# EAGLE design usbasp2lagig (EAGLE 6.6.0)
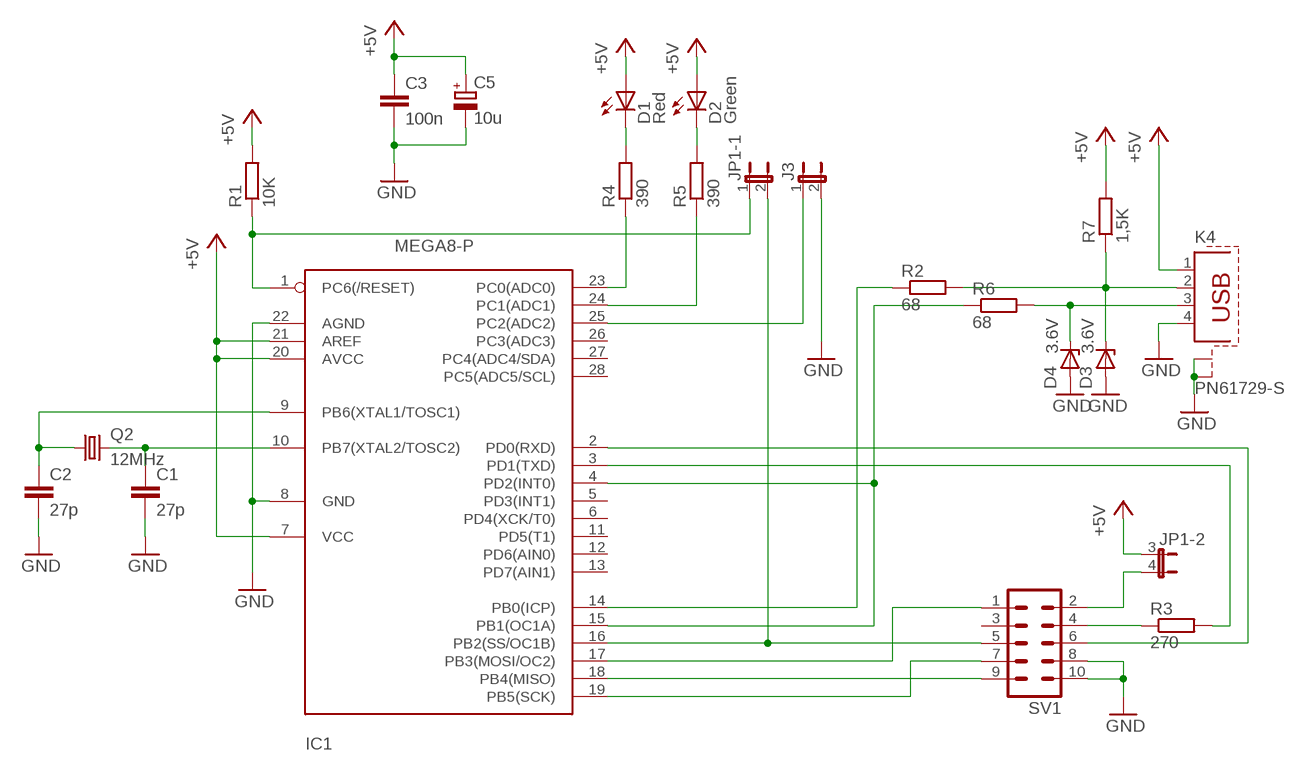
[diagram p0: schematic, sheet 1]

## Parts
C1  27p  C-EU025-024X044  [C025-024X044]
C2  27p  C-EU025-024X044  [C025-024X044]
C3  100n  C5/3  [C5B3]
C5  10u  CPOL-EUE2.5-5  [E2,5-5]
D1  Red  LED5MM  [LED5MM]
D2  Green  LED5MM  [LED5MM]
D3  3.6V  ZENER-DIODEDO34-7  [DO34Z7]
D4  3.6V  ZENER-DIODEDO34-7  [DO34Z7]
IC1  MEGA8-P  [DIL28-3]
J3  JP1E  [JP1]
JP1  JP2QE  [JP2Q]
K4  PN61729-S  [PN61729-S]
Q2  12MHz  CRYSTALHC49S  [HC49/S]
R1  10K  R-EU_0207/7  [0207/7]
R2  68  R-EU_0207/7  [0207/7]
R3  270  R-EU_0207/7  [0207/7]
R4  390  R-EU_0207/7  [0207/7]
R5  390  R-EU_0207/7  [0207/7]
R6  68  R-EU_0207/7  [0207/7]
R7  1,5K  R-EU_0207/7  [0207/7]
SV1  ML10LANG  [ML10_LANG]

## Nets
+5V: C3.1 C5.+ D1.A D2.A IC1.7(VCC) IC1.20(AVCC) IC1.21(AREF) JP1.3 K4.1 R1.2 R7.2
GND: C1.2 C2.2 C3.2 C5.- D3.A D4.A IC1.8(GND) IC1.22(AGND) J3.2 K4.4 K4.S1 K4.S2 SV1.8 SV1.10
N$1: D3.C K4.2 R2.2 R7.1
N$2: D4.C K4.3 R6.2
N$3: C1.1 IC1.10(PB7(XTAL2/TOSC2)) Q2.2
N$4: C2.1 IC1.9(PB6(XTAL1/TOSC1)) Q2.1
N$5: JP1.4 SV1.2
N$6: R3.1 SV1.4
N$7: IC1.3(PD1(TXD)) R3.2
N$8: IC1.2(PD0(RXD)) SV1.6
N$9: IC1.17(PB3(MOSI/OC2)) SV1.1
N$11: IC1.18(PB4(MISO)) SV1.9
N$12: IC1.16(PB2(SS/OC1B)) JP1.2 SV1.5
N$13: IC1.1(PC6(/RESET)) JP1.1 R1.1
N$14: IC1.14(PB0(ICP)) R2.1
N$15: IC1.25(PC2(ADC2)) J3.1
N$16: IC1.23(PC0(ADC0)) R4.1
N$17: IC1.24(PC1(ADC1)) R5.1
N$18: IC1.4(PD2(INT0)) IC1.15(PB1(OC1A)) R6.1
N$19: D1.K(C) R4.2
N$20: D2.K(C) R5.2
N$23: IC1.19(PB5(SCK)) SV1.7
Unconnected: IC1.5(PD3(INT1)) IC1.6(PD4(XCK/T0)) IC1.11(PD5(T1)) IC1.12(PD6(AIN0)) IC1.13(PD7(AIN1)) IC1.26(PC3(ADC3)) IC1.27(PC4(ADC4/SDA)) IC1.28(PC5(ADC5/SCL)) SV1.3

## Library data of the parts
C1 C2 = rcl:C-EU: CAPACITOR, European symbol
C3 = capacitor-wima:C: CAPACITOR naming: grid - package width
C5 = rcl:CPOL-EU: POLARIZED CAPACITOR, European symbol
D1 D2 = tim:LED: LED OSRAM: - CHIPLED LG R971, LG N971, LY N971, LG Q971, LY Q971, LO R971, LY R971 LH N974, LH R974 LS Q976, LO Q976, LY Q976 LO Q996 - Hyper CHIPLED LW Q18S LB Q993, LB Q99A, LB R99A - SideLED LS A670, LO A670, LY A670, LG A670, LP A670 LB A673, LV A673, LT A673, LW A673 LH A674 LY A675 LS A676, LA A676, LO A676, LY A676, LW A676 LS A679, LY A679, LG A679 - Hyper Micro SIDELED® LS Y876, LA Y876, LO Y876, LY Y876 LT Y87S - SmartLED LW L88C, LW L88S LB L89C, LB L89S, LG L890 LS L89K, LO L89K, LY L89K LS L896, LA L896, LO L896, LY L896 - TOPLED LS T670, LO T670, LY T670, LG T670, LP T670 LSG T670, LSP T670, LSY T670, LOP T670, LYG T670 LG T671, LOG T671, LSG T671 LB T673, LV T673, LT T673, LW T673 LH T674 LS T676, LA T676, LO T676, LY T676, LB T676, LH T676, LSB T676, LW T676 LB T67C, LV T67C, LT T67C, LS T67K, LO T67K, LY T67K, LW E67C LS E67B, LA E67B, LO E67B, LY E67B, LB E67C, LV E67C, LT E67C LW T67C LS T679, LY T679, LG T679 LS T770, LO T770, LY T770, LG T770, LP T770 LB T773, LV T773, LT T773, LW T773 LH T774 LS E675, LA E675, LY E675, LS T675 LS T776, LA T776, LO T776, LY T776, LB T776 LHGB T686 LT T68C, LB T68C - Hyper Mini TOPLED® LB M676 - Mini TOPLED Santana® LG M470 LS M47K, LO M47K, LY M47K Source: http://www.osram.convergy.de LUXEON: - LUMILED® LXK2-PW12-R00, LXK2-PW12-S00, LXK2-PW14-U00, LXK2-PW14-V00 LXK2-PM12-R00, LXK2-PM12-S00, LXK2-PM14-U00 LXK2-PE12-Q00, LXK2-PE12-R00, LXK2-PE12-S00, LXK2-PE14-T00, LXK2-PE14-U00 LXK2-PB12-K00, LXK2-PB12-L00, LXK2-PB12-M00, LXK2-PB14-N00, LXK2-PB14-P00, LXK2-PB14-Q00 LXK2-PR12-L00, LXK2-PR12-M00, LXK2-PR14-Q00, LXK2-PR14-R00 LXK2-PD12-Q00, LXK2-PD12-R00, LXK2-PD12-S00 LXK2-PH12-R00, LXK2-PH12-S00 LXK2-PL12-P00, LXK2-PL12-Q00, LXK2-PL12-R00 Source: www.luxeon.com KINGBRIGHT: KA-3528ASYC Source: www.kingbright.com
D3 D4 = diode:ZENER-DIODE: Z-Diode
IC1 = tim:MEGA8-P: MICROCONTROLLER 8 Kbytes FLASH 1 kbytes SRAM 512 bytes EEPROM USART 4-channel 10 bit ADC 2-channel 8 bit ADC
J3 = jumper:JP1E: JUMPER
JP1 = jumper:JP2QE: JUMPER
K4 = tim:PN61729-S: BERG USB connector; OC_FARNELL: unknown; OC_NEWARK: unknown
Q2 = tim:CRYSTAL: CRYSTAL; OC_FARNELL: 1667008; OC_NEWARK: unknown
R1-R7 = rcl:R-EU_: RESISTOR, European symbol
SV1 = conbig:ML10: HARTING

## Board
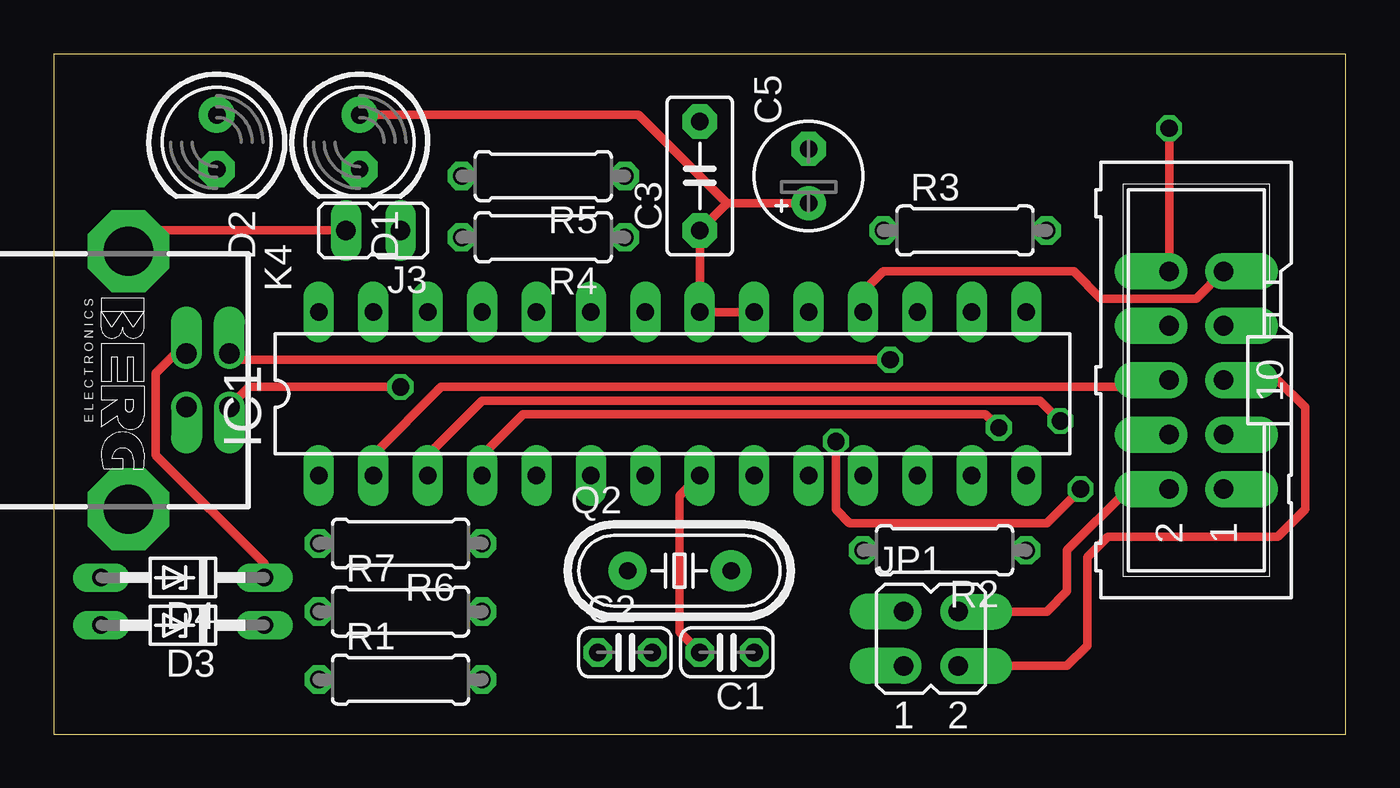
[diagram p1: board, top side]
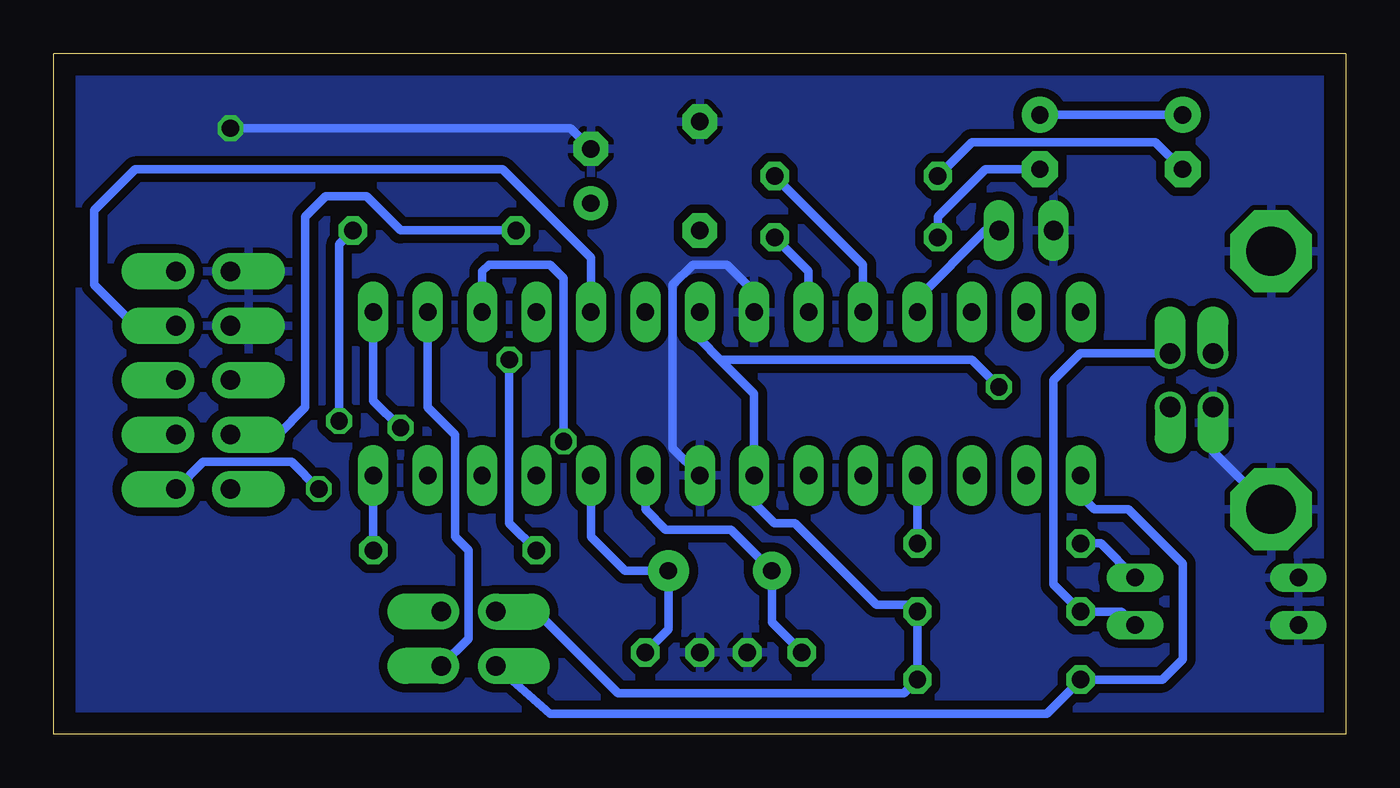
[diagram p2: board, bottom side, seen from below]

Size 60.33 x 31.75 mm. Coordinates in mm from the lower left corner, seen from the top.
Outline: 0,0 60.33,0 60.33,31.75 0,31.75 0,0
Copper layers (1*16): Top 0.035mm / dielectric 1.5mm / Bottom 0.035mm
Design rules "default": minimum track width 10mil, minimum drill 24mil, track to track 8mil, track to pad 8mil, pad to pad 8mil, via to via 8mil, smd to smd 8mil, copper to edge 40mil, drill to drill 8mil, minimum pad ring 10mil, minimum via ring 8mil, stop-mask expansion 4mil, vias tented up to drill 0mil, thermal gap 10mil

### Footprints (pad centres in the part's own frame; a part is rotated, then mirrored left to right if it is on the bottom)
C025-024X044 = drill 0.813 octagon: 1 -1.27,0; 2 1.27,0
C5B3 = drill 0.813 pad 1.6 octagon: 1 -2.54,0; 2 2.54,0
E2,5-5 = drill 0.813 pad 1.6: + -1.27,0 | drill 0.813 pad 1.6 octagon: - 1.27,0
LED5MM = drill 0.813 pad 1.676: A -1.27,0 | drill 0.813 pad 1.676 octagon: K 1.27,0
DO34Z7 = drill 0.813 long: A 3.81,0; C -3.81,0
DIL28-3 = drill 0.813 pad 1.422 long: 1 -16.51,-3.81; 2 -13.97,-3.81; 3 -11.43,-3.81; 4 -8.89,-3.81; 5 -6.35,-3.81; 6 -3.81,-3.81; 7 -1.27,-3.81; 8 1.27,-3.81; 9 3.81,-3.81; 10 6.35,-3.81; 11 8.89,-3.81; 12 11.43,-3.81; 13 13.97,-3.81; 14 16.51,-3.81; 15 16.51,3.81; 16 13.97,3.81; 17 11.43,3.81; 18 8.89,3.81; 19 6.35,3.81; 20 3.81,3.81; 21 1.27,3.81; 22 -1.27,3.81; 23 -3.81,3.81; 24 -6.35,3.81; 25 -8.89,3.81; 26 -11.43,3.81; 27 -13.97,3.81; 28 -16.51,3.81
JP1 = drill 0.914 long: 1 0,-1.27; 2 0,1.27
JP2Q = drill 0.914 pad 1.676 offset: 1 -1.27,-1.27; 2 1.27,-1.27; 3 -1.27,1.27; 4 1.27,1.27
PN61729-S = drill 0.95 pad 1.422 offset: 1 1.25,4.71; 2 -1.25,4.71; 3 -1.25,2.71; 4 1.25,2.71 | drill 2.3 pad 3.81 octagon: S1 -6.02,0; S2 6.02,0
HC49/S = drill 0.813 pad 1.778: 1 -2.413,0 | drill 0.813 pad 1.93: 2 2.413,0
0207/7 = drill 0.813 octagon: 1 -3.81,0; 2 3.81,0
ML10_LANG = drill 0.914 pad 1.7 offset: 1 -5.08,-1.27; 2 -5.08,1.27; 3 -2.54,-1.27; 4 -2.54,1.27; 5 0,-1.27; 6 0,1.27; 7 2.54,-1.27; 8 2.54,1.27; 9 5.08,-1.27; 10 5.08,1.27

### Placement (x,y rotation side)
C1  31.43,3.81 180 top
C2  26.67,3.81 0 top
C3  30.16,26.04 90 top
C5  35.24,26.04 90 top
D1  14.29,27.62 270 top
D2  7.62,27.62 270 top
D3  6.03,5.08 180 top
D4  6.03,7.3 180 top
IC1  28.89,15.88 0 top
J3  14.92,23.5 90 top
JP1  40.96,4.45 0 top
K4  3.49,16.51 270 top
Q2  29.21,7.62 0 top
R1  16.19,2.54 0 top
R2  41.59,8.57 180 top
R3  42.55,23.5 0 top
R4  22.86,23.18 180 top
R5  22.86,26.04 180 top
R6  16.19,8.89 180 top
R7  16.19,5.71 0 top
SV1  53.34,16.51 90 top

### Tracks (layer width: path | path; a pad name or v marks a point on that pad's centre or on a via)
+5V  (via drill 0.8)
  Top 0.406: K4.1 9.13,16.19 v16.19,16.19 | IC1.20 IC1.21 C3.1 31.43,24.77 | 31.43,24.77 C5.+ | D1.A 27.3,28.89 31.43,24.77
  Bottom 0.406: D2.A D1.A | 29.21,17.46 27.62,15.88 IC1.7 27.62,10.79 26.67,9.84 25.72,9.84 21.91,6.03 20.32,6.03 R7.2 R1.2 20.64,1.91 33.97,1.91 37.78,5.71 JP1.3 | IC1.21 30.16,18.41 29.21,17.46 | 29.21,17.46 17.46,17.46 v16.19,16.19
GND  (via drill 0.8)
  Top 0.406: C1.2 29.21,4.76 29.21,11.11 IC1.8 | K4.S1 4.46,23.5 J3.2 | SV1.10 v52.07,28.26
  Bottom 0.406: IC1.8 31.43,13.34 31.43,20.95 30.48,21.91 28.89,21.91 27.62,20.64 IC1.22 | v52.07,28.26 36.2,28.26 C5.- | K4.4 6.2,13.2 K4.S2
  pour Bottom (isolate 0.406, rank 4): 0,0 60.33,0 60.33,31.75 0,31.75
N$1  (via drill 0.8)
  Top 0.406: K4.2 8.5,17.46 v39.05,17.46
  Bottom 0.406: D3.C 10.48,5.71 R7.1 13.65,6.99 13.65,16.51 12.4,17.76 K4.2 | R2.2 39.05,9.84 v39.05,17.46
N$2
  Top 0.406: K4.3 5.7,17.76 4.76,16.83 4.76,13.02 9.84,7.94 D4.C
  Bottom 0.406: R6.2 11.43,8.89 D4.C
N$3
  Bottom 0.406: C1.1 31.62,4.89 Q2.2 33.66,7.62 35.24,9.21 IC1.10
N$4
  Bottom 0.406: C2.1 26.8,5.21 Q2.1 28.7,9.53 31.75,9.53 32.7,10.48 IC1.9
N$5
  Top 0.406: SV1.2 50.16,11.43 47.31,8.57 47.31,6.67 46.35,5.71 JP1.4
N$6
  Bottom 0.406: R3.1 44.13,23.5 45.72,25.08 47.62,25.08 48.58,24.13 48.58,15.24 49.85,13.97 SV1.4
N$7  (via drill 0.8)
  Top 0.406: IC1.3 17.46,13.02 20,15.56 46.04,15.56 v46.99,14.61
  Bottom 0.406: v46.99,14.61 46.99,22.86 R3.2
N$8
  Top 0.406: IC1.2 14.92,13.02 18.1,16.19 51.75,16.19 SV1.6
N$9  (via drill 0.8)
  Top 0.406: v47.94,11.43 46.35,9.84 37.15,9.84 36.51,10.48 v36.51,13.65
  Bottom 0.406: SV1.1 53.34,12.7 49.21,12.7 v47.94,11.43 | v36.51,13.65 36.51,21.27 37.15,21.91 40.01,21.91 40.32,21.59 IC1.17
N$11
  Top 0.406: IC1.18 37.78,20.64 38.73,21.59 47.62,21.59 48.9,20.32 53.34,20.32 SV1.9
N$12
  Top 0.406: SV1.5 57.15,16.51 58.42,15.24 58.42,10.48 57.15,9.21 49.21,9.21 48.26,8.26 48.26,4.13 47.31,3.17 JP1.2
  Bottom 0.406: JP1.2 40.96,4.45 40.96,8.57 41.59,9.21 41.59,13.97 42.86,15.24 IC1.16
N$13
  Bottom 0.406: IC1.1 12.38,11.11 11.75,10.48 10.16,10.48 7.62,7.94 7.62,3.49 8.57,2.54 R1.1 13.97,0.95 37.15,0.95 JP1.1
N$14
  Bottom 0.406: IC1.14 R2.1
N$15
  Bottom 0.406: IC1.25 20,20.32 16.83,23.5 J3.1
N$16
  Bottom 0.406: R4.1 25.08,21.59 IC1.23
N$17
  Bottom 0.406: R5.1 22.54,21.91 IC1.24
N$18  (via drill 0.8)
  Top 0.406: IC1.4 20,13.02 21.91,14.92 43.5,14.92 v44.13,14.29
  Bottom 0.406: R6.1 IC1.4 | v44.13,14.29 45.4,15.56 IC1.15
N$19
  Bottom 0.406: D1.K 16.83,26.35 19.05,24.13 R4.2
N$20
  Bottom 0.406: D2.K 8.89,27.62 17.46,27.62 R5.2
N$23
  Bottom 0.406: IC1.19 35.24,22.23 39.37,26.35 56.52,26.35 58.42,24.45 58.42,20.95 56.52,19.05 SV1.7